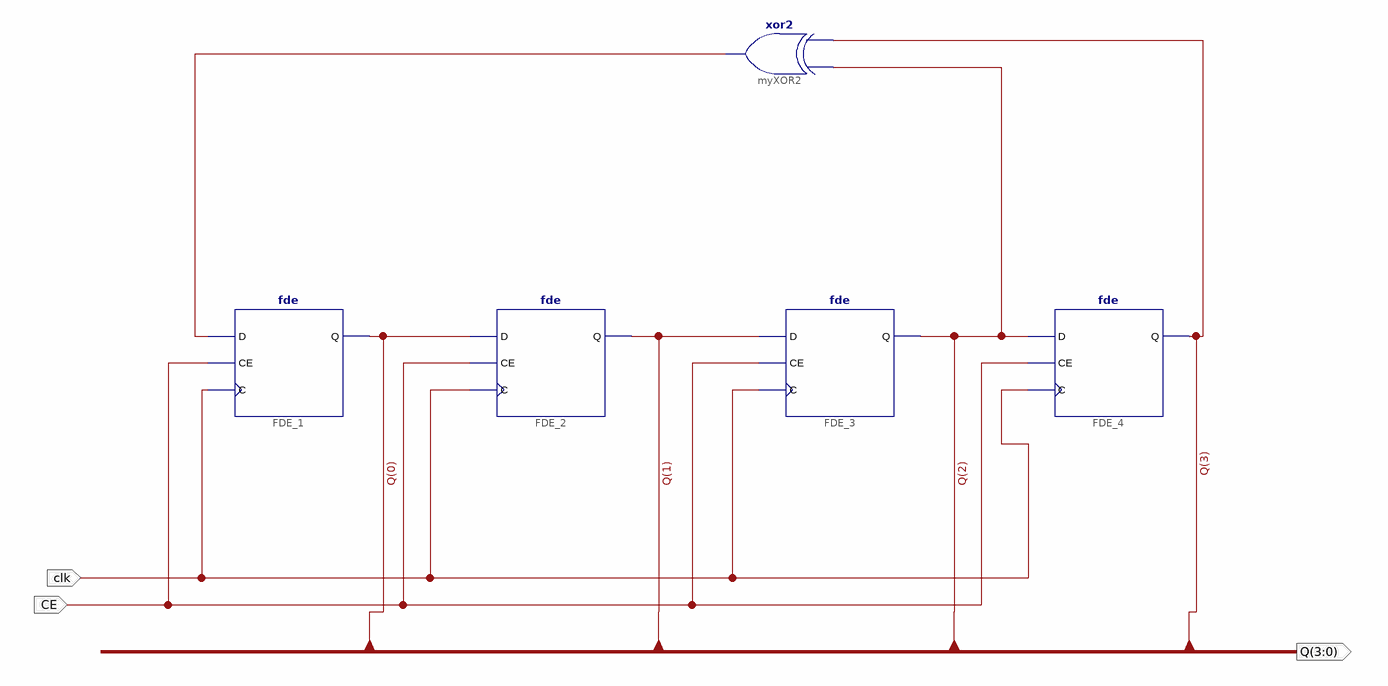
[diagram p0: schematic sheet 1]
// Xilinx ISE schematic RDM.sch (spartan6) as structural Verilog: 5 symbols, 3 ports
module RDM (
  input  CE,
  input  clk,
  output [3:0] Q
);

  wire XLXN_2;

  fde #(.INIT("1")) FDE_1 (.C(clk), .CE(CE), .D(XLXN_2), .Q(Q[0]));
  fde FDE_2 (.C(clk), .CE(CE), .D(Q[0]), .Q(Q[1]));
  fde FDE_3 (.C(clk), .CE(CE), .D(Q[1]), .Q(Q[2]));
  fde FDE_4 (.C(clk), .CE(CE), .D(Q[2]), .Q(Q[3]));
  xor myXOR2 (XLXN_2, Q[3], Q[2]);
endmodule
